# Altium schematic sheet P08_KEY_BOOT SET.SchDoc
size 420 x 297 mm
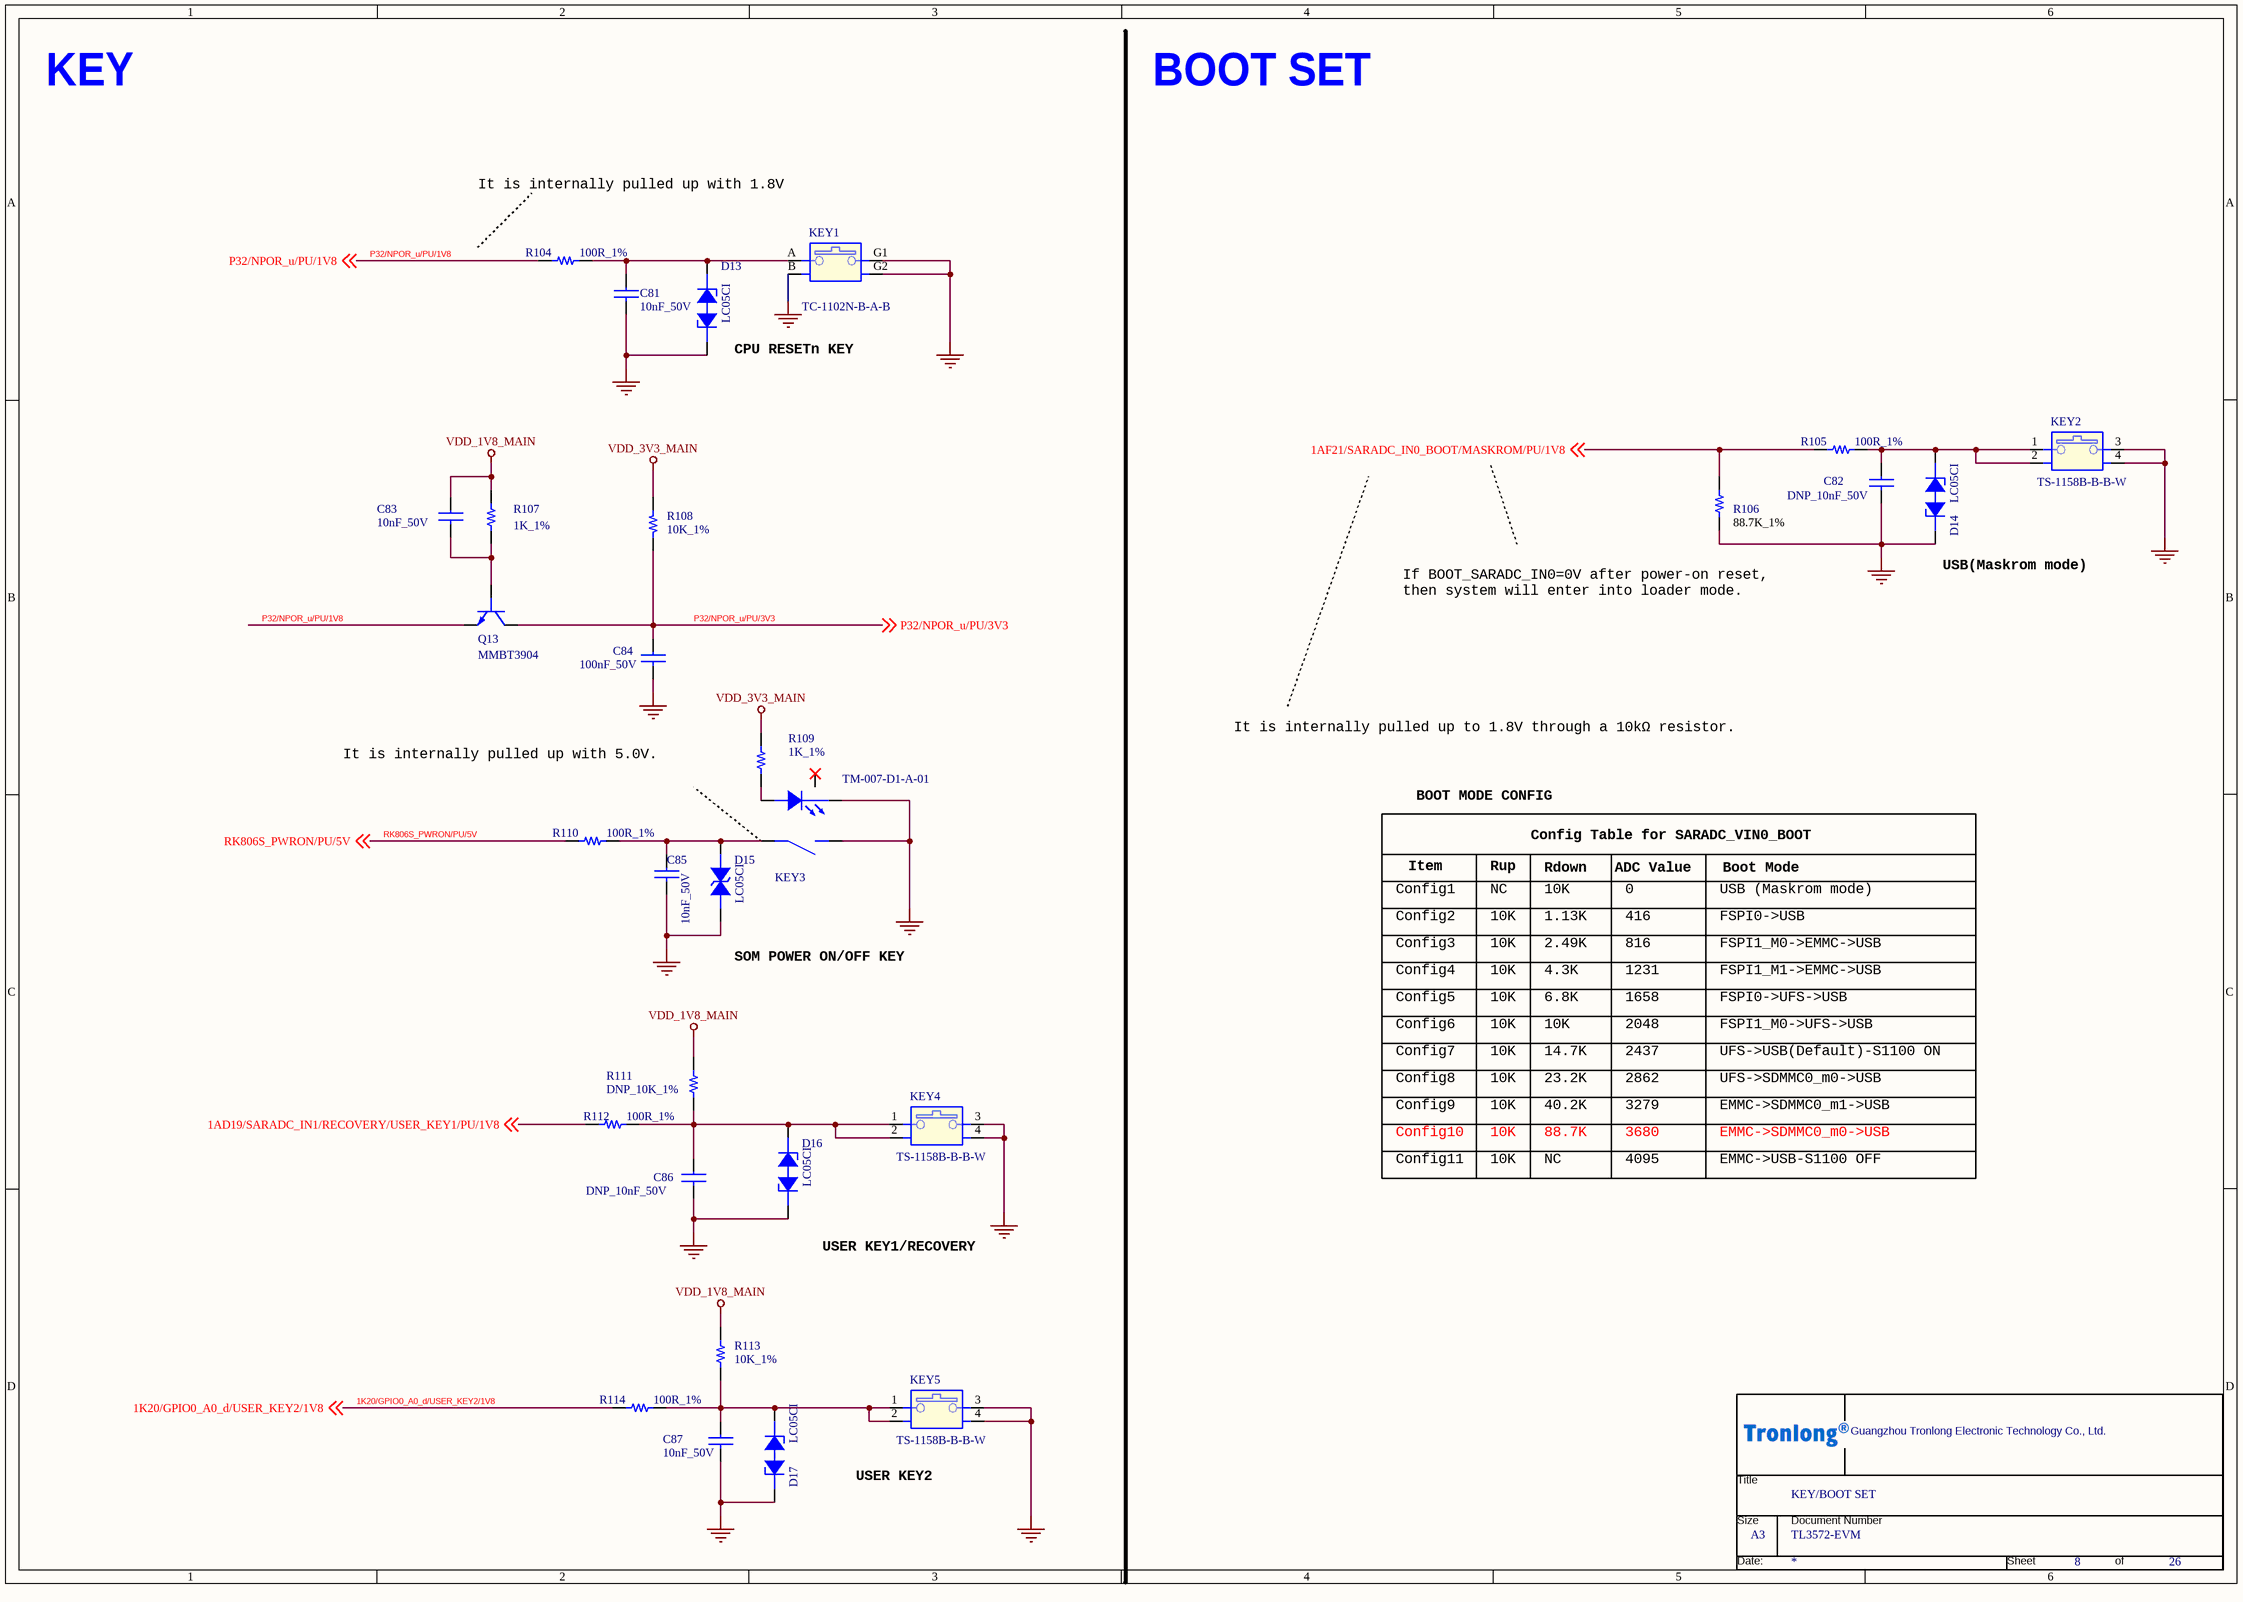
[diagram p0: P08_KEY_BOOT SET.SchDoc]

## Parts
*  Page Count: 26  Page Number: 8  Page Size: A3  OrgName: Guangzhou Tronlong Electronic Technology Co., Ltd.  Title: KEY/BOOT SET  Doc: TL3572-EVM  (hidden comment: TL_NEW)  (graphical)
C81  10nF_50V  [C0402]
C82  DNP_10nF_50V  [C0402]
C83  10nF_50V  [C0402]
C84  100nF_50V  [C0402]
C85  10nF_50V  [C0402]
C86  DNP_10nF_50V  [C0402]
C87  10nF_50V  [C0402]
D13  LC05CI  [SOD323]
D14  LC05CI  [SOD323]
D15  LC05CI  [SOD323]
D16  LC05CI  [SOD323]
D17  LC05CI  [SOD323]
KEY1  TC-1102N-B-A-B  [sw_evq-pf003m]
KEY2  TS-1158B-B-B-W  [TS-1158B-B-B-W]
KEY3  TM-007-D1-A-01  [sw-th_xkb_tm-007-d1-a-01]
KEY4  TS-1158B-B-B-W  [TS-1158B-B-B-W]
KEY5  TS-1158B-B-B-W  [TS-1158B-B-B-W]
Q13  MMBT3904  [SOT23-3_DBZ3]
R104  100R_1%  [R0402]
R105  100R_1%  [R0402]
R106  88.7K_1%  [R0402]
R107  1K_1%  [R0402]
R108  10K_1%  [R0402]
R109  1K_1%  [R0603]
R110  100R_1%  [R0402]
R111  DNP_10K_1%  [R0402]
R112  100R_1%  [R0402]
R113  10K_1%  [R0402]
R114  100R_1%  [R0402]

## Nets
GND: C81.2 C82.2 C84.2 C85.2 C86.2 C87.2 D13.2(CATHODE2) D14.2(CATHODE2) D15.2 D16.2(CATHODE2) D17.2(CATHODE2) KEY1.B KEY1.G1 KEY1.G2 KEY2.3 KEY2.4 KEY3.2 KEY3.3(CATHODE) KEY4.3 KEY4.4 KEY5.3 KEY5.4 R106.2
VDD_1V8_MAIN: C83.1 R107.1 R111.2 R113.2
VDD_3V3_MAIN: R108.1 R109.1
1AD19/SARADC_IN1/RECOVERY/USER_KEY1/PU/1V8: R112.1 ; off-sheet 1AD19/SARADC_IN1/RECOVERY/USER_KEY1/PU/1V8
1AF21/SARADC_IN0_BOOT/MASKROM/PU/1V8: R105.1 R106.1 ; off-sheet 1AF21/SARADC_IN0_BOOT/MASKROM/PU/1V8
1K20/GPIO0_A0_d/USER_KEY2/1V8: R114.1 ; off-sheet 1K20/GPIO0_A0_d/USER_KEY2/1V8
P32/NPOR_u/PU/1V8: Q13.2(E) R104.1 ; off-sheet P32/NPOR_u/PU/1V8
P32/NPOR_u/PU/3V3: C84.1 Q13.3(C) R108.2 ; off-sheet P32/NPOR_u/PU/3V3
RK806S_PWRON/PU/5V: R110.1 ; off-sheet RK806S_PWRON/PU/5V
NetC81_1: C81.1 D13.1(ANODE1) KEY1.A R104.2
NetC82_1: C82.1 D14.1(ANODE1) KEY2.1 KEY2.2 R105.2
NetC83_2: C83.2 Q13.1(B) R107.2
NetC85_1: C85.1 D15.1 KEY3.1 R110.2
NetC86_1: C86.1 D16.1(ANODE1) KEY4.1 KEY4.2 R111.1 R112.2
NetC87_1: C87.1 D17.1(ANODE1) KEY5.1 KEY5.2 R113.1 R114.2
NetKEY3_4: KEY3.4(ANODE) R109.2

Not connected (* = marked no-connect by the designer): KEY3 5(NPTH)*

## Notes on the sheet
- KEY
- BOOT SET
- It is internally pulled up with 1.8V
- (near D13) CPU RESETn KEY
- (near R106) If BOOT_SARADC_IN0=0V after power-on reset,
  then system will enter into loader mode.
- (near D14) USB(Maskrom mode)
- It is internally pulled up to 1.8V through a 10kΩ resistor.
- It is internally pulled up with 5.0V.
- BOOT MODE CONFIG
- Config Table for SARADC_VIN0_BOOT
- Config1
- Config2
- Item
- Rup
- NC
- 10K
- Rdown
- 1.13K
- ADC Value
- 0
- 416
- USB (Maskrom mode)
- FSPI0->USB
- Boot Mode
- (near D15) SOM POWER ON/OFF KEY
- Config3
- Config4
- Config5
- 6.8K
- 2.49K
- 4.3K
- 1658
- 1231
- 816
- FSPI1_M0->EMMC->USB
- FSPI0->UFS->USB
- FSPI1_M1->EMMC->USB
- Config6
- Config7
- 14.7K
- 2048
- 2437
- UFS->USB(Default)-S1100 ON
- FSPI1_M0->UFS->USB
- Config10
- Config9
- Config8
- 40.2K
- 88.7K
- 23.2K
- 3279
- 3680
- 2862
- EMMC->SDMMC0_m1->USB
- EMMC->SDMMC0_m0->USB
- UFS->SDMMC0_m0->USB
- Config11
- 4095
- EMMC->USB-S1100 OFF
- (near D16) USER KEY1/RECOVERY
- (near KEY5) USER KEY2
- (in symbol TL_NEW) Title; Size; Document Number; Date:; Sheet; of

## Library data of the parts
* = TL_NEW: RevCode: A?; Page Create Date: March  8, 1995; Page Modify Date: *; Document: TL3572-EVM
C81 = CAP NP_Dup3: 贴片陶瓷电容,10nF,10%,50V,X7R; Manufacturer PartNumber: 0402B103K500NT; Manufacturer: 广东风华高新科技股份有限公司（FH）; Manufacturer Character: 中国大陆; Operation Temperature（℃）: -55~+125(Ta); room: KEY; As-Welded: /; ERP Number: 005.0001.0001.00522; Eco-Label: ROHS; Part Status: 优选; PCB Footprint: C0402
C82 = CAP NP_Dup3: 贴片陶瓷电容,10nF,10%,50V,X7R; Manufacturer Character: 中国大陆; Manufacturer PartNumber: 0402B103K500NT; Manufacturer: 广东风华高新科技股份有限公司（FH）; Eco-Label: ROHS; ERP Number: 005.0001.0001.00522; room: KEY; Operation Temperature（℃）: -55~+125(Ta); As-Welded: DNP; Temperature: -55~125℃; Part Status: 优选; PCB Footprint: C0402
C83 = CAP NP_Dup3: 贴片陶瓷电容,10nF,10%,50V,X7R; Manufacturer: 广东风华高新科技股份有限公司（FH）; Manufacturer PartNumber: 0402B103K500NT; Manufacturer Character: 中国大陆; As-Welded: /; Operation Temperature（℃）: -55~+125(Ta); ERP Number: 005.0001.0001.00522; Eco-Label: ROHS; Part Status: 优选; PCB Footprint: C0402
C84 = CAP NP_Dup3: 贴片陶瓷电容,100nF,10%,50V,X7R; Manufacturer: 广东风华高新科技股份有限公司（FH）; Manufacturer PartNumber: 0402B104K500NT; Manufacturer Character: 中国大陆; As-Welded: /; Operation Temperature（℃）: -55~+125(Ta); ERP Number: 005.0001.0001.00681; Eco-Label: ROHS; Part Status: 试用; PCB Footprint: C0402
C85 = CAP NP_Dup3: 贴片陶瓷电容,10nF,10%,50V,X7R; Manufacturer Character: 中国大陆; Manufacturer: 广东风华高新科技股份有限公司（FH）; Manufacturer PartNumber: 0402B103K500NT; room: KEY; Operation Temperature（℃）: -55~+125(Ta); As-Welded: /; ERP Number: 005.0001.0001.00522; Eco-Label: ROHS; Part Status: 优选; PCB Footprint: C0402
C86 = CAP NP_Dup3: 贴片陶瓷电容,10nF,10%,50V,X7R; Manufacturer: 广东风华高新科技股份有限公司（FH）; Manufacturer PartNumber: 0402B103K500NT; Manufacturer Character: 中国大陆; Eco-Label: ROHS; ERP Number: 005.0001.0001.00522; Operation Temperature（℃）: -55~+125(Ta); room: KEY; As-Welded: DNP; Part Status: 优选; Temperature: -55~125℃; PCB Footprint: C0402
C87 = CAP NP_Dup3: 贴片陶瓷电容,10nF,10%,50V,X7R; Manufacturer: 广东风华高新科技股份有限公司（FH）; Manufacturer PartNumber: 0402B103K500NT; Manufacturer Character: 中国大陆; Eco-Label: ROHS; ERP Number: 005.0001.0001.00522; As-Welded: /; Operation Temperature（℃）: -55~+125(Ta); room: KEY; Part Status: 优选; Temperature: -55~125℃; PCB Footprint: C0402
D13 = DIODE BREAKDOWN_2: TVS二极管,VRWM=5V,VBR=6V,一组,双向,30KV,30KV; Manufacturer Character: 中国大陆; Manufacturer: 上海雷卯电子科技有限公司（Leiditech）; room: KEY; Operation Temperature（℃）: -55~+125(Tj); As-Welded: /; ERP Number: 005.0001.0017.00060; Eco-Label: ROHS; Part Status: 优选; Manufacturer PartNumber: LC05CI; Manufacturer Part Number: LC05CI; Temperature: -55~155℃; PCB Footprint: SOD323
D14 = DIODE BREAKDOWN_2: TVS二极管,VRWM=5V,VBR=6V,一组,双向,30KV,30KV; Manufacturer Character: 中国大陆; Manufacturer: 上海雷卯电子科技有限公司（Leiditech）; Eco-Label: ROHS; ERP Number: 005.0001.0017.00060; As-Welded: /; room: KEY; Operation Temperature（℃）: -55~+125(Tj); Part Status: 优选; Manufacturer Part Number: LC05CI; Manufacturer PartNumber: LC05CI; Temperature: -60~150℃; PCB Footprint: SOD323
D15 = DIODE-BI: TVS二极管,VRWM=5V,VBR=6V,一组,双向,30KV,30KV; Manufacturer: 上海雷卯电子科技有限公司（Leiditech）; Manufacturer Character: 中国大陆; Eco-Label: ROHS; ERP Number: 005.0001.0017.00060; As-Welded: /; Operation Temperature（℃）: -55~+125(Tj); room: KEY; Temperature: -55~155℃; Manufacturer Part Number: LC05CI; Manufacturer PartNumber: LC05CI; Part Status: 优选; PCB Footprint: SOD323
D16 D17 = DIODE BREAKDOWN_2: TVS二极管,VRWM=5V,VBR=6V,一组,双向,30KV,30KV; Manufacturer: 上海雷卯电子科技有限公司（Leiditech）; Manufacturer Character: 中国大陆; Operation Temperature（℃）: -55~+125(Tj); room: KEY; As-Welded: /; ERP Number: 005.0001.0017.00060; Eco-Label: ROHS; Temperature: -60~150℃; Manufacturer PartNumber: LC05CI; Manufacturer Part Number: LC05CI; Part Status: 优选; PCB Footprint: SOD323
KEY1 = SW PUSHBUTTON-SPST SHIELD_3: 插件侧按按键,4P,90,黑色,H=7mm,带支架; Manufacturer: 广东星坤科技股份有限公司（XKB）; Manufacturer Character: 中国大陆; Eco-Label: ROHS; ERP Number: 005.0001.0016.00088; As-Welded: /; Operation Temperature（℃）: -40~+85(Ta); Manufacturer PartNumber: TC-1102N-B-A-B; Part Status: 测评; PCB Footprint: sw_evq-pf003m
KEY2 KEY4 = SW PUSHBUTTON-SPST SHIELD_0: 贴片按键,4P,180,白色,H=3.5mm; Manufacturer Character: 中国大陆; Manufacturer: 广东星坤科技股份有限公司（XKB）; Operation Temperature（℃）: -30~+85(Ta); room: KEY; ERP Number: 005.0001.0016.00072; As-Welded: /; Eco-Label: ROHS; Manufacturer PartNumber: TS-1158B-B-B-W; Part Status: 优选; PCB Footprint: TS-1158B-B-B-W
KEY3 = LED_5: 插件侧按按键,4P,90,白色,H=8.7,带灯; Manufacturer: 广东星坤科技股份有限公司（XKB）; Manufacturer Character: 中国大陆; Operation Temperature（℃）: -40~+85(Ta); As-Welded: /; ERP Number: 005.0001.0016.00102; Eco-Label: ROHS; Temperature: -40~105℃; Manufacturer PartNumber: TM-007-D1-A-01; Part Status: 测评; PCB Footprint: sw-th_xkb_tm-007-d1-a-01
KEY5 = SW PUSHBUTTON-SPST SHIELD_0: 贴片按键,4P,180,白色,H=3.5mm; Manufacturer: 广东星坤科技股份有限公司（XKB）; Manufacturer Character: 中国大陆; Eco-Label: ROHS; As-Welded: /; ERP Number: 005.0001.0016.00072; room: KEY; Operation Temperature（℃）: -30~+85(Ta); Manufacturer PartNumber: TS-1158B-B-B-W; Part Status: 优选; PCB Footprint: TS-1158B-B-B-W
Q13 = MMBT3904/SOT: BJT,NPN,Vceo=40V,Ic=200mA,fT=300MHz,PD=200mW; Manufacturer: 江苏长晶科技股份有限公司（JSCJ）; Manufacturer Character: 中国大陆; Operation Temperature（℃）: -55~+150(Tj); As-Welded: /; ERP Number: 005.0001.0008.00002; Eco-Label: ROHS; Part Status: 优选; Manufacturer PartNumber: MMBT3904; Temperature: -55~150℃; PCB Footprint: SOT23-3_DBZ3
R104 R110 R112 = Resistor_Dup4: 贴片电阻,100R,±1%,1/16W; Manufacturer Character: 中国大陆; Manufacturer PartNumber: RC-02K1000FT; Manufacturer: 广东风华高新科技股份有限公司（FH）; CLASS: DISCRETE; As-Welded: /; Operation Temperature（℃）: -55~+155(Ta); ERP Number: 005.0001.0002.01314; Eco-Label: ROHS; Part Status: 试用; Temperature: -55~155℃; PCB Footprint: R0402
R105 = Resistor_Dup4: 贴片电阻,100R,±1%,1/16W; Manufacturer Character: 中国大陆; Manufacturer PartNumber: RC-02K1000FT; Manufacturer: 广东风华高新科技股份有限公司（FH）; CLASS: DISCRETE; room: JTAG; Operation Temperature（℃）: -55~+155(Ta); As-Welded: /; ERP Number: 005.0001.0002.01314; Eco-Label: ROHS; Part Status: 试用; Temperature: -55~155℃; PCB Footprint: R0402
R106 = Resistor_Dup1: 贴片电阻,88.7K,±1%,1/16W; Manufacturer Character: 中国大陆; Manufacturer PartNumber: RC-02K8872FT; Manufacturer: 广东风华高新科技股份有限公司（FH）; CLASS: DISCRETE; Eco-Label: ROHS; ERP Number: 005.0001.0002.01437; As-Welded: /; Operation Temperature（℃）: -55~+155(Ta); RK PN: 901006427-1; Priority: A; Optional: X; Part Status: 测评; Part Type: NC电阻; Created by: JJJ; PCB Footprint: R0402
R107 = Resistor_Dup4: 贴片电阻,0R,±1%,1/16W; Manufacturer PartNumber: RC-02000FT; Manufacturer: 广东风华高新科技股份有限公司（FH）; Manufacturer Character: 中国大陆; CLASS: DISCRETE; Operation Temperature（℃）: -55~+155(Ta); As-Welded: /; ERP Number: 005.0001.0002.00938; Eco-Label: ROHS; Part Status: 优选; PCB Footprint: R0402
R108 = Resistor_Dup4: 贴片电阻,10K,±1%,1/16W; Manufacturer Character: 中国大陆; Manufacturer PartNumber: RC-02K1002FT; Manufacturer: 广东风华高新科技股份有限公司（FH）; CLASS: DISCRETE; Eco-Label: ROHS; As-Welded: /; Operation Temperature（℃）: -55~+125(Ta); ERP Number: 005.0001.0002.01326; Part Status: 优选; PCB Footprint: R0402
R109 = Resistor_Dup4: 贴片电阻,1K,±1%,1/10W; Manufacturer PartNumber: RS-03K1001FT; Manufacturer: 广东风华高新科技股份有限公司（FH）; Manufacturer Character: 中国大陆; CLASS: DISCRETE; Operation Temperature（℃）: -55~+155(Ta); As-Welded: /; ERP Number: 005.0001.0002.00961; Eco-Label: ROHS; Part Status: 优选; PCB Footprint: R0603
R111 = Resistor_Dup4: 贴片电阻,10K,±1%,1/16W; Manufacturer Character: 中国大陆; Manufacturer: 广东风华高新科技股份有限公司（FH）; Manufacturer PartNumber: RC-02K1002FT; CLASS: DISCRETE; As-Welded: DNP; ERP Number: 005.0001.0002.01326; room: KEY; Operation Temperature（℃）: -55~+125(Ta); Eco-Label: ROHS; Part Status: 优选; Temperature: -55~125℃; PCB Footprint: R0402
R113 = Resistor_Dup4: 贴片电阻,10K,±1%,1/16W; Manufacturer PartNumber: RC-02K1002FT; Manufacturer: 广东风华高新科技股份有限公司（FH）; Manufacturer Character: 中国大陆; CLASS: DISCRETE; Eco-Label: ROHS; Operation Temperature（℃）: -55~+125(Ta); room: KEY; ERP Number: 005.0001.0002.01326; As-Welded: /; Part Status: 优选; Temperature: -55~125℃; PCB Footprint: R0402
R114 = Resistor_Dup4: 贴片电阻,100R,±1%,1/16W; Manufacturer: 广东风华高新科技股份有限公司（FH）; Manufacturer PartNumber: RC-02K1000FT; Manufacturer Character: 中国大陆; CLASS: DISCRETE; Eco-Label: ROHS; ERP Number: 005.0001.0002.01314; Operation Temperature（℃）: -55~+155(Ta); As-Welded: /; Part Status: 试用; Temperature: -55~155℃; PCB Footprint: R0402